# Altium schematic sheet 9  - UV OV Protection.SchDoc
size A4
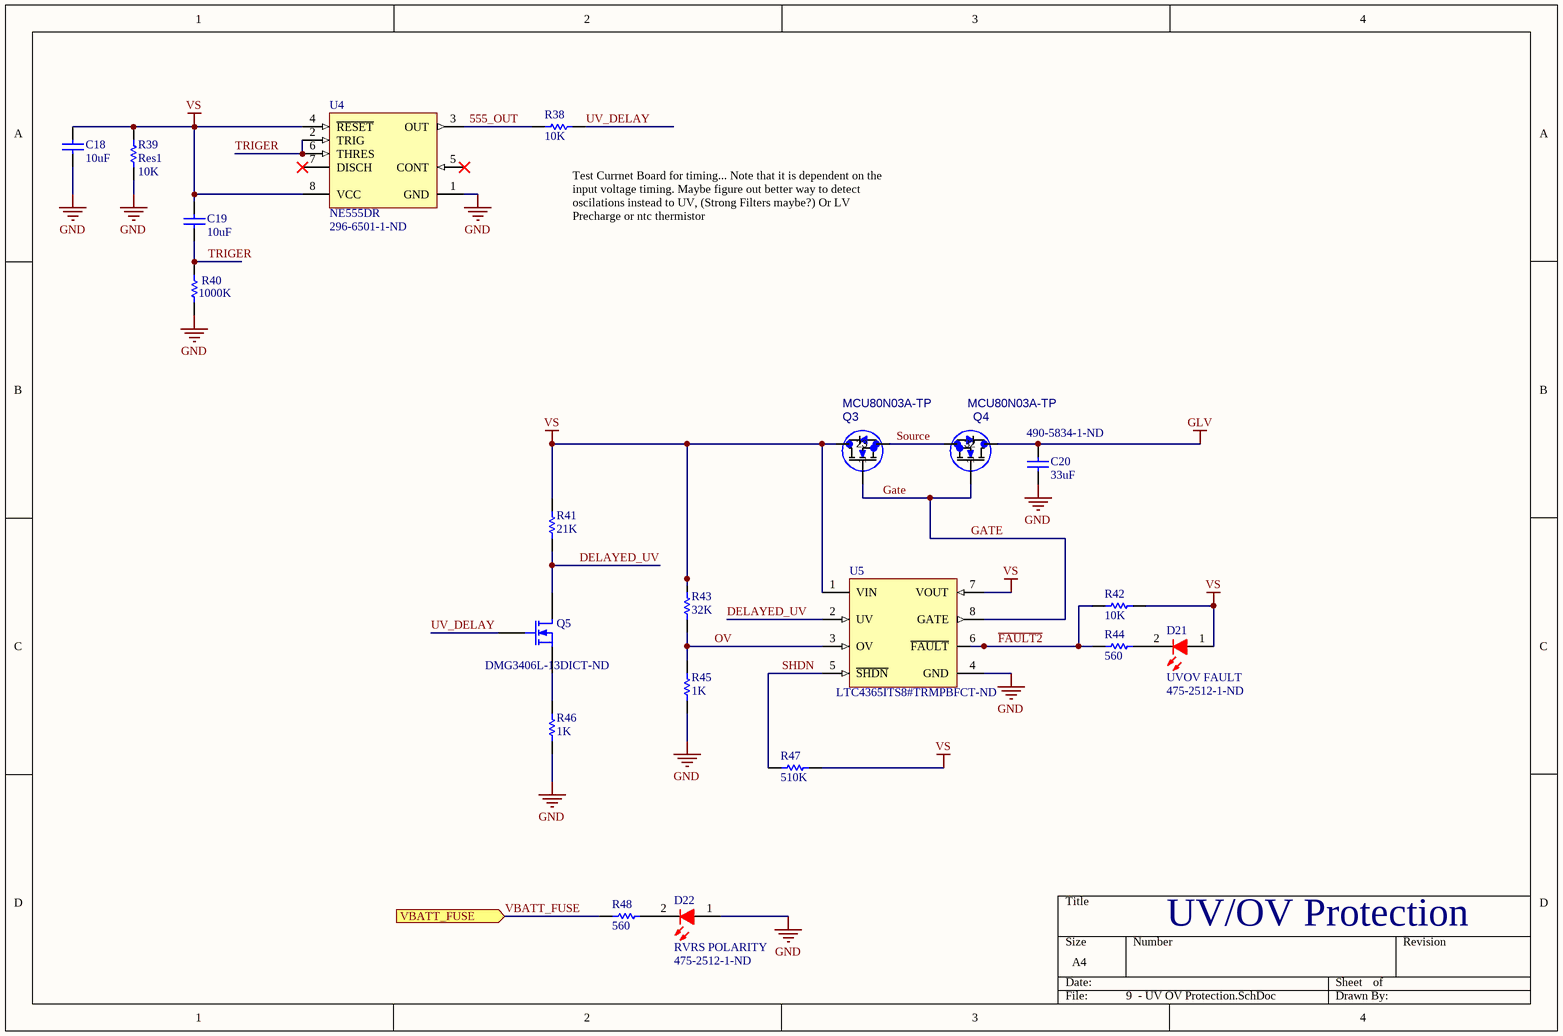
[diagram p0: 9  - UV OV Protection.SchDoc]

## Parts
C18  value 10uF  [1608[0603]]  (hidden comment: Cap Semi)
C19  value 10uF  [1608[0603]]  (hidden comment: Cap Semi)
C20  value 33uF  Supplier Part Number 1: 490-5834-1-ND  [2J-Lead 6.1 x 5.3]  (hidden comment: Cap Semi)
D21  UVOV FAULT  Supplier Part Number 1: 475-2512-1-ND  [TOSH-0603LED_RED_V]
D22  RVRS POLARITY  Supplier Part Number 1: 475-2512-1-ND  [TOSH-0603LED_RED_V]
Q3  MCU80N03A-TP  [MCU80N_MCE]
Q4  MCU80N03A-TP  [MCU80N_MCE]
Q5  Supplier Part Number 1: DMG3406L-13DICT-ND  [SOT-23_N]
R38  10K  [RESC0603(1608)_L]
R39  Res1  value 10K  [1608[0603]]
R40  1000K  [RESC0603(1608)_L]
R41  21K  [RESC0603(1608)_L]
R42  10K  [RESC0603(1608)_L]
R43  32K  [RESC0603(1608)_L]
R44  560  [RESC0603(1608)_L]
R45  1K  [RESC0603(1608)_L]
R46  1K  [RESC0603(1608)_L]
R47  510K  [RESC0603(1608)_L]
R48  560  [RESC0603(1608)_L]
U4  NE555DR  Supplier Part Number 1: 296-6501-1-ND  [D0008A_M]
U5  Supplier Part Number 1: LTC4365ITS8#TRMPBFCT-ND  [LT-TS8-8-TSOT-23_V]  (hidden comment: LTC4365ITS8#TRMPBF)

## Ports
VBATT_FUSE (in)

## Nets
GLV: C20.1 Q4.2
GND: C18.1 C20.2 D22.1(A) R39.1 R40.1 R45.1 R46.2 U4.1(GND) U5.4(GND)
VS: C18.2 C19.2 D21.1(A) Q3.2 R39.2 R41.1 R42.1 R43.2 R47.1 U4.4(~{RESET}) U4.8(VCC) U5.1(VIN) U5.7(VOUT)
555_OUT: R38.1 U4.3(OUT)
DELAYED_UV: Q5.3(D) R41.2 U5.2(UV)
~{FAULT2}: R42.2 R44.1 U5.6(~{FAULT})
GATE: Q3.1 Q4.1 U5.8(GATE)
OV: R43.1 R45.2 U5.3(OV)
SHDN: R47.2 U5.5(~{SHDN})
Source: Q3.3 Q4.3
TRIGER: C19.1 R40.2 U4.2(TRIG) U4.6(THRES)
UV_DELAY: Q5.1(G) R38.2
VBATT_FUSE: R48.1 ; port VBATT_FUSE
NetD21_2: D21.2(K) R44.2
NetD22_2: D22.2(K) R48.2
NetQ5_2: Q5.2(S) R46.1

Not connected (* = marked no-connect by the designer): U4 5(CONT)* 7(DISCH)*

## Notes on the sheet
- (near R38) Test Currnet Board for timing... Note that it is dependent on the input voltage timing. Maybe figure out better way to detect oscilations instead to UV, (Strong Filters maybe?) Or LV Precharge or ntc thermistor
- UV/OV Protection

## Library data of the parts
C18-C20 = Cap Semi: Capacitor (Semiconductor SIM Model); Published: 8-Jun-2000; LatestRevisionDate: 29-May-2009; LatestRevisionNote: IPC-7351 Footprint Added.; PackageReference: C1206; Publisher: Altium Limited; PackageDescription: Chip Capacitor; Supplier 1: Digi-Key
  C18 C19: Supplier Part Number 1: 490-10991-1-ND
D21 D22 = CMP-0444-00001-1: LED, Red 0603 (1608) 63mCd; Manufacturer: Toshiba; PartNumber: TLSU1008A(T04); Forward Current: 25 mA; Power Dissipation: 60 mW; Packing Type: Reel; Reverse Voltage: 4 V; Mounting Technology: Surface Mount; PackageDescription: 2-Pin SMT LED, 1.6 x 0.8 mm Pitch; ComponentLink1URL: http://www.toshiba-components.com/; ComponentLink1Description: Manufacturer URL; PackageReference: 0603LED_RED; ComponentLink2URL: http://www.semicon.toshiba.co.jp/info/docget.jsp?type=datasheet&lang=en&pid=TLSU1008A(T04); ComponentLink2Description: Datasheet; DatasheetVersion: Aug-08; Storage Temperature: -40 to 100 degC; Supplier 1: Digi-Key
Q3 Q4 = MCU80N03A-TP: Mfr_Name: MCC; C: Copyright (C) 2018 Accelerated Designs. All rights reserved; Copyright: Copyright (C) 2022 Ultra Librarian. All rights reserved.; Manufacturer_Part_Number: MCU80N03A-TP; Value: MCU80N03A-TP
Q5 = MOSFET-N: N-Channel MOSFET; Manufacturer: Infineon Technologies; Manufacturer Part Number: IPD075N03L G; FET Type: MOSFET N-Channel, Metal Oxide; FET Feature: Logic Level Gate; Drain to Source Voltage (Vdss): 30V; Current - Continuous Drain (Id) @ 25°C: 50A (Tc); Rds On (Max) @ Id, Vgs: 7.5 mOhm @ 30A, 10V; Vgs(th) (Max) @ Id: 2.2V @ 250µA; Gate Charge (Qg) @ Vgs: 18nC @ 10V; Input Capacitance (Ciss) @ Vds: 1900pF @ 15V; Power - Max: 47W; Published: 8-Jun-2000; LatestRevisionDate: 17-Jul-2002; LatestRevisionNote: Re-released for DXP Platform.; PackageVersion: 1995/1996; PackageReference: E3; Publisher: Altium Limited; PackageDescription: TO, Flat Index; 3 In-Line, Axial Leads; Body Dia. 4.6mm; Lead Dia. 0.5 mm (max); RoHS: RoHS Compliant; Category: Discrete Semiconductor Products; Packaging: Cut Tape (CT); Mounting Type: Surface Mount; Package / Case: TO-252-3, DPak (2 Leads + Tab), SC-63; Supplier Device Package: PG-TO252-3; ComponentLink1URL: http://www.infineon.com/dgdl/Infineon-IPD075N03LG-DS-v02_01-en.pdf?folderId=5546d4694909da4801490a07012f053b&fileId=db3a30431936bc4b011951d824f83aeb; ComponentLink1Description: http://www.infineon.com/dgdl/Infineon-IPD075N03LG-DS-v02_01-en.pdf?folderId=5546d4694909da4801490a07012f053b&fileId=db3a30431936bc4b011951d824f83aeb; ComponentLink2URL: http://www.semicon.toshiba.co.jp/info/docget.jsp?type=datasheet&lang=en&pid=SSM3K329R; ComponentLink2Description: http://www.semicon.toshiba.co.jp/info/docget.jsp?type=datasheet&lang=en&pid=SSM3K329R; Supplier 1: Digi-Key
R38 R40-R48 = CMP-1591-00001-1: 0603 (1608 Metric) Chip Resistor; Case-Metric: 1608; Case-EIA: 0603; PackageReference: RESC0603(1608)
  R38 R42: Supplier 1: Digi-Key; Supplier Part Number 1: 311-10KGRCT-ND
  R40 R43 R45: Supplier 1: Digi-Key
  R44: Supplier 1: Digi-Key; Supplier Part Number 1: P430BZCT-ND
  R48: Supplier 1: Digi-Key; Supplier Part Number 1: P560BZCT-ND
R39 = Res1: RES SMD 10K OHM 5% 1/4W 0603; Manufacturer: Rohm Semiconductor; Manufacturer Part Number: ESR03EZPJ103; Power (Watts): 0.25W, 1/4W; Temperature Coefficient: ±200ppm/°C; Published: 8-Jun-2000; LatestRevisionDate: 17-Jul-2002; LatestRevisionNote: Re-released for DXP Platform.; PackageReference: AXIAL-0.3; Publisher: Altium Limited; PackageDescription: Axial Device, Thru-Hole; 2 Leads; 0.3 in Pin Spacing; Supplier 1: Digi-Key; Supplier Part Number 1: RHM10KDCT-ND; RoHS: RoHS Compliant; Category: Resistors; Stock 1: 0; Pricing 1: 1=0.15, 10=0.119, 25=0.0824, 50=0.0642, 100=0.0458, 250=0.03568, 500=0.02836, 1000=0.02012 (CAD); Packaging: Cut Tape (CT); Part Status: Active; Resistance (Ohms): 10k; Tolerance: ±5%; Composition: Thick Film; Features: Automotive AEC-Q200, Pulse Withstanding; Operating Temperature: -55°C ~ 155°C; Package / Case: 0603 (1608 Metric); Supplier Device Package: 0603; Size / Dimension: 0.063" L x 0.031" W (1.60mm x 0.80mm); Height - Seated (Max): 0.022" (0.55mm); Failure Rate: -; ComponentLink1URL: http://rohmfs.rohm.com/en/products/databook/datasheet/passive/resistor/chip_resistor/esr.pdf; ComponentLink1Description: http://rohmfs.rohm.com/en/products/databook/datasheet/passive/resistor/chip_resistor/esr.pdf
U4 = CMP-1685-00007-1: Precision Timer, 4.5 to 16 V, 0 to 70 degC, 8-Pin SOIC (D8), Green (RoHS & no Sb/Br), Tape and Reel; Forward Voltage: 450 mV; Forward Current: 1 A; Max Surge Current: 30 A; Peak Reverse Current: 500 uA; Case\Package: SMA; PackageReference: D0008A; Width: 2.84 mm; PackageDescription: 8-Pin Small Outline Integrated Circuit, Body 4.9 x 3.9 mm, Pitch 1.27 mm; DatasheetVersion: SLFS022I, 09/2014; ComponentLink2Description: Datasheet; Package Quantity: 1; REACH SVHC: Unknown; Radiation Hardening: No; Height: 2.44 mm; Code_JEDEC: MS-012; Pins: 2; ComponentLink1Description: Manufacturer URL; ComponentLink3Description: Package Specification; ComponentLink3URL: http://www.ti.com/lit/ml/msoi002j/msoi002j.pdf; Length: 4.57 mm; ComponentLink1URL: http://www.ti.com/; Mount: Surface Mount; PackageVersion: 4040047-3/M, 06/2011; ComponentLink2URL: http://www.ti.com/general/docs/lit/getliterature.tsp?genericPartNumber=NE555&fileType=pdf; RoHSCompliant: true; Max Operating Temperature: 125 degC; Packaging: Cut Tape; Min Operating Temperature: -55 degC; Supplier 1: Digi-Key
U5 = CMP-0474-00861-1: UV, OV and Reverse Supply Protection Controller, 2.5 to 34 V Vin, 8-pin SOT23 (TS8-8), -40 to 85 degC, Pb-Free, Mini Tape and Reel; Manufacturer: Linear Technology; Fault: yes; Fast Comparator: no; Extended Temp: C, I, H; Circuit Breakers(#): 1; RoHS: TRUE; ComponentLink2URL: http://cds.linear.com/docs/en/datasheet/4365f.pdf; PartNumber: LTC4365ITS8#TRMPBF; ComponentLink3Description: Package Specification; Power Good: no; Packing: Mini Tape and Reel; ComponentLink2Description: Datasheet; Vin Range: 2.5 to 34 V; Active Limiting: no; Foldback: no; Reset: no; ComponentLink3URL: http://cds.linear.com/docs/en/packaging/SOT_8_05-08-1637.pdf; PackageVersion: Rev. A, 08/2010; Code_JEDEC: MO-193; ComponentLink1Description: Manufacturer URL; Mounting Technology: Surface Mount; ComponentLink1URL: http://www.linear.com/; PackageDescription: 8-Pin Plastic TSOT-23, Body 2.9 x 1.63 mm, Pitch 0.65 mm; PackageReference: TS8-8; Supplier 1: Digi-Key